# Altium project radxa_c200_io_board_v1.11.PrjPcb (part 6 of 8)

## Sheet 16_HDMI&DP.SchDoc: C200
size 594 x 420 mm; Page Create Date: March  8, 1995; Page Number: 16; Page Size: A2; Comment: radxa_1010; Page Count: 21; RevCode: V1.11; Doc: 16_HDMI&DP; DsnPath: D:\WMS\C200\CC122\对外\C200 V1.11.DSN; SchematicName: c200; PageName: 16_HDMI&DP; PageSize: A2; TopSchematic: True
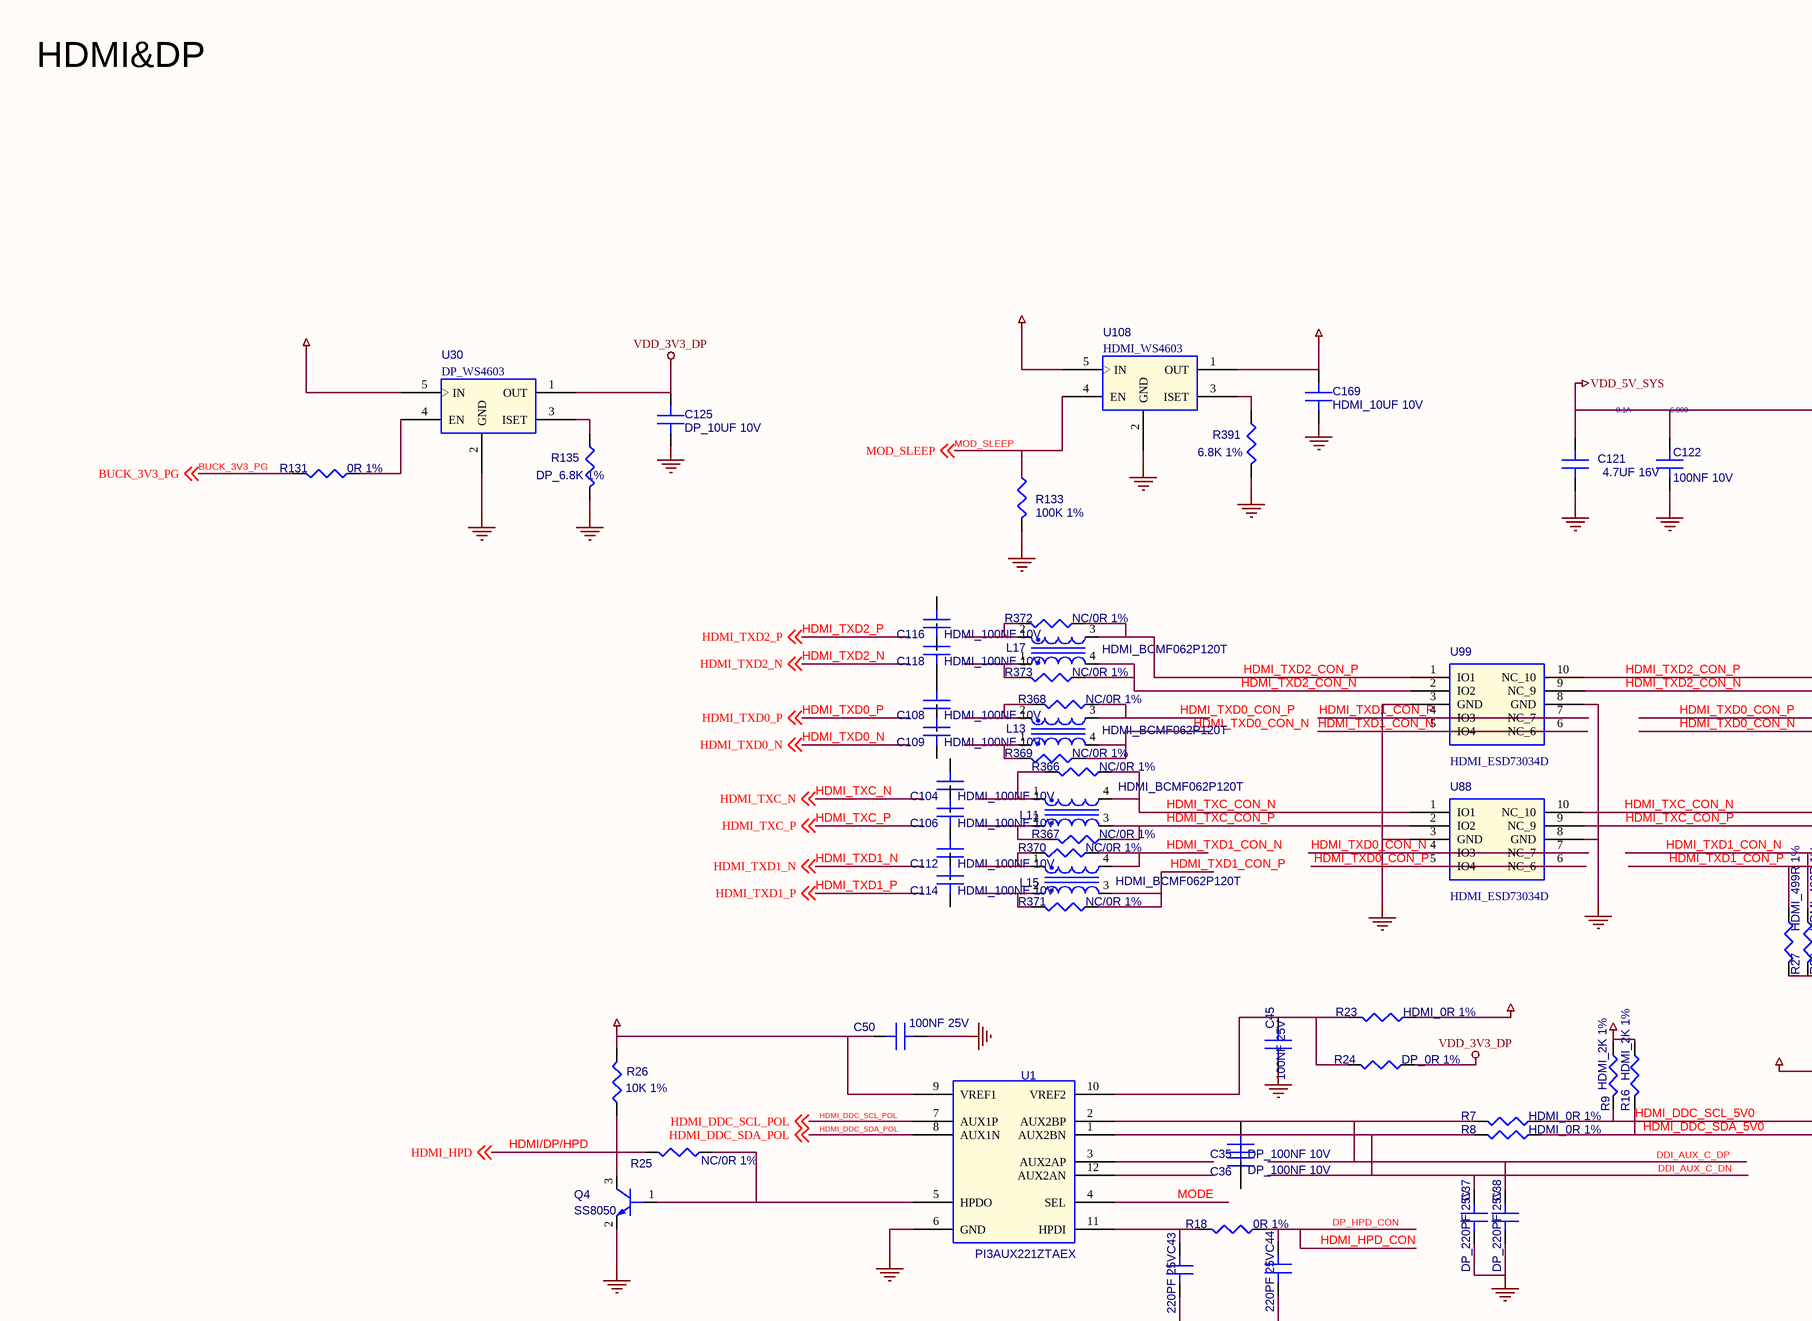
[diagram p30: 16_HDMI&DP.SchDoc, top left]
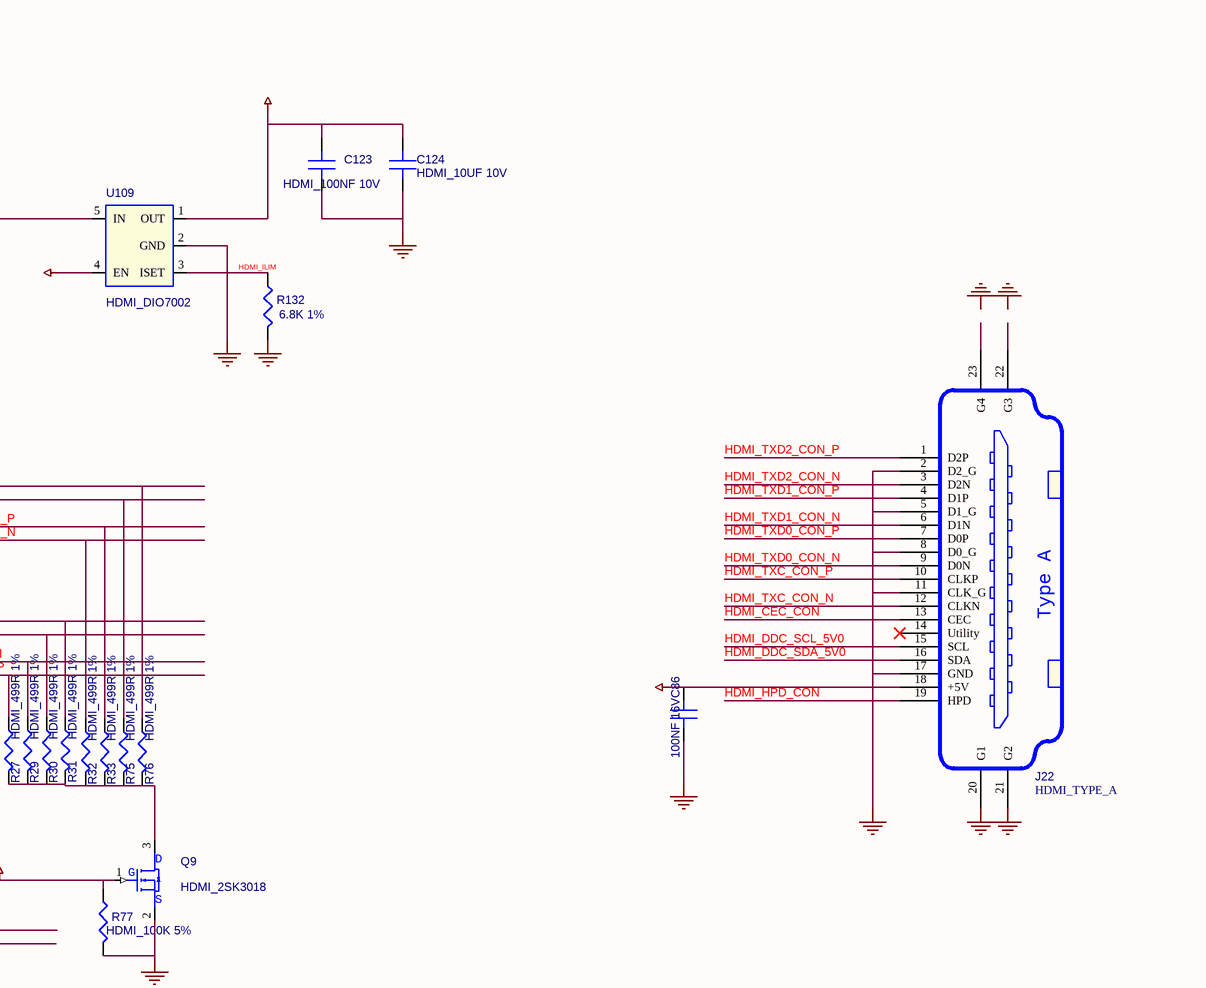
[diagram p31: 16_HDMI&DP.SchDoc, top right]
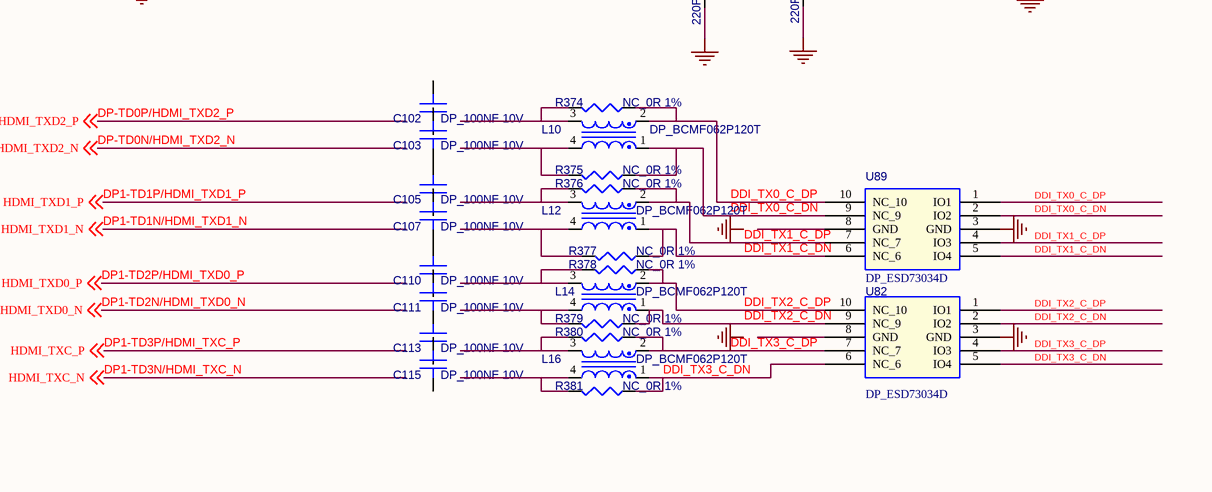
[diagram p32: 16_HDMI&DP.SchDoc, bottom left]
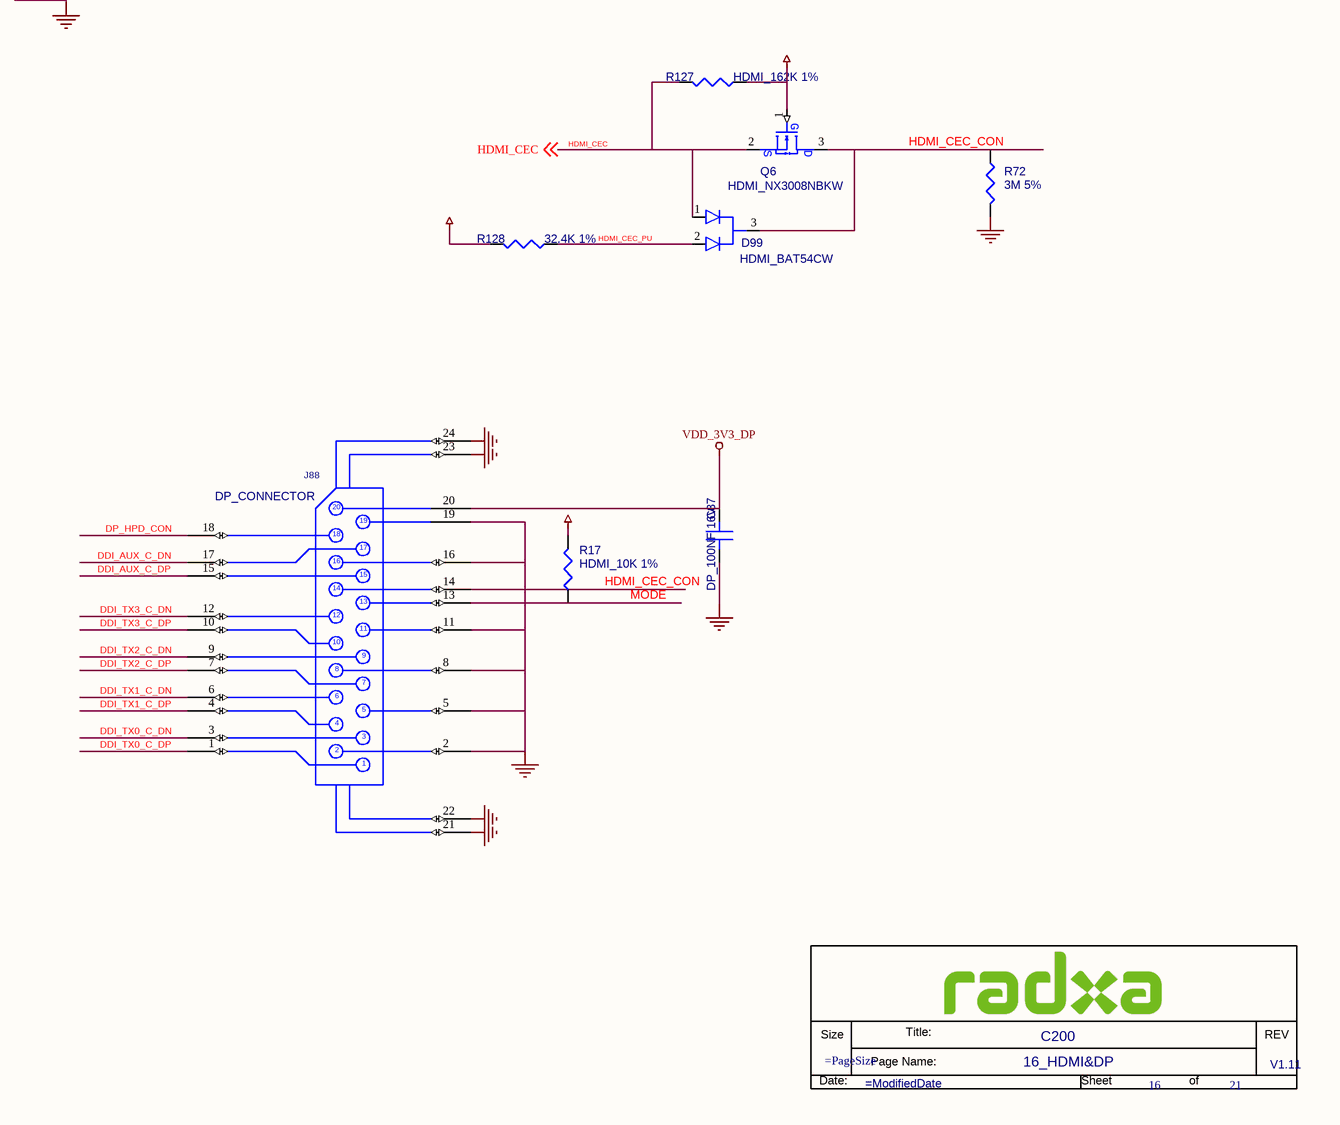
[diagram p33: 16_HDMI&DP.SchDoc, bottom right]

### Parts
(Parts that share a designator on the sheet are numbered #1, #2 ... from top to bottom, then left to right.)
*#15  Doc: 16_HDMI&DP  RevCode: V1.11  Title: C200  Page Number: 16  Page Count: 21  (hidden comment: radxa_1010)  (graphical)
C35  DP_100NF 10V  [C0402]
C36  DP_100NF 10V  [C0402]
C37  DP_220PF 25V  [C0201]
C38  DP_220PF 25V  [C0201]
C43  220PF 25V  [C0201]
C44  220PF 25V  [C0201]
C45  100NF 25V  [C0402]
C50  100NF 25V  [C0402]
C86  100NF 16V  [C0201]
C87  DP_100NF 16V  [C0201]
C102  DP_100NF 10V  [C0402]
C103  DP_100NF 10V  [C0402]
C104  HDMI_100NF 10V  [C0402]
C105  DP_100NF 10V  [C0402]
C106  HDMI_100NF 10V  [C0402]
C107  DP_100NF 10V  [C0402]
C108  HDMI_100NF 10V  [C0402]
C109  HDMI_100NF 10V  [C0402]
C110  DP_100NF 10V  [C0402]
C111  DP_100NF 10V  [C0402]
C112  HDMI_100NF 10V  [C0402]
C113  DP_100NF 10V  [C0402]
C114  HDMI_100NF 10V  [C0402]
C115  DP_100NF 10V  [C0402]
C116  HDMI_100NF 10V  [C0402]
C118  HDMI_100NF 10V  [C0402]
C121  4.7UF 16V  [C0603]
C122  100NF 10V  [C0402]
C123  HDMI_100NF 10V  [C0402]
C124  HDMI_10UF 10V  [C0603]
C125  DP_10UF 10V  [C0603]
C169  HDMI_10UF 10V  [C0603]
D99  HDMI_BAT54CW  [SOT323]
J22  HDMI_TYPE_A  [HDMI_SM19_0D5_LIE]
J88  DP_CONNECTOR  [DP_SM20_17D0X17D0]
L10  DP_BCMF062P120T  [LC1210]
L11  HDMI_BCMF062P120T  [LC1210]
L12  DP_BCMF062P120T  [LC1210]
L13  HDMI_BCMF062P120T  [LC1210]
L14  DP_BCMF062P120T  [LC1210]
L15  HDMI_BCMF062P120T  [LC1210]
L16  DP_BCMF062P120T  [LC1210]
L17  HDMI_BCMF062P120T  [LC1210]
Q4  SS8050  [SOT_323]
Q6  HDMI_NX3008NBKW  [SOT_323]
Q9  HDMI_2SK3018  [SOT_323]
R7  HDMI_0R 1%  [R0402]
R8  HDMI_0R 1%  [R0402]
R9  HDMI_2K 1%  [R0402]
R16  HDMI_2K 1%  [R0402]
R17  HDMI_10K 1%  [R0402]
R18  0R 1%  [R0402]
R23  HDMI_0R 1%  [R0402]
R24  DP_0R 1%  [R0402]
R25  NC/0R 1%  [R0402]
R26  10K 1%  [R0402]
R27  HDMI_499R 1%  [R0402]
R29  HDMI_499R 1%  [R0402]
R30  HDMI_499R 1%  [R0402]
R31  HDMI_499R 1%  [R0402]
R32  HDMI_499R 1%  [R0402]
R33  HDMI_499R 1%  [R0402]
R72  3M 5%  [R0402]
R75  HDMI_499R 1%  [R0402]
R76  HDMI_499R 1%  [R0402]
R77  HDMI_100K 5%  [R0402]
R127  HDMI_162K 1%  [R0402]
R128  32.4K 1%  [R0402]
R131  0R 1%  [R0402]
R132  6.8K 1%  [R0402]
R133  100K 1%  [R0402]
R135  DP_6.8K 1%  [R0402]
R366  NC/0R 1%  [R0402]
R367  NC/0R 1%  [R0402]
R368  NC/0R 1%  [R0402]
R369  NC/0R 1%  [R0402]
R370  NC/0R 1%  [R0402]
R371  NC/0R 1%  [R0402]
R372  NC/0R 1%  [R0402]
R373  NC/0R 1%  [R0402]
R374  NC_0R 1%  [R0402]
R375  NC_0R 1%  [R0402]
R376  NC_0R 1%  [R0402]
R377  NC_0R 1%  [R0402]
R378  NC_0R 1%  [R0402]
R379  NC_0R 1%  [R0402]
R380  NC_0R 1%  [R0402]
R381  NC_0R 1%  [R0402]
R391  6.8K 1%  [R0402]
U1  PI3AUX221ZTAEX  [UQFN12_0D4_2]
U30  DP_WS4603  [SOT23_5]
U82  DP_ESD73034D  [XSON10_0D5_1D1X2D6]
U88  HDMI_ESD73034D  [XSON10_0D5_1D1X2D6]
U89  DP_ESD73034D  [XSON10_0D5_1D1X2D6]
U99  HDMI_ESD73034D  [XSON10_0D5_1D1X2D6]
U108  HDMI_WS4603  [SOT23_5]
U109  HDMI_DIO7002  [SOT23_5]

### Nets
GND: C37.2(B) C38.2(B) C43.2(B) C44.2(B) C45.2(B) C50.2(B) C86.2(B) C87.2(B) C121.2(B) C122.2(B) C123.2(B) C124.2(B) C125.2(B) C169.2(B) J22.2(D2_G) J22.5(D1_G) J22.8(D0_G) J22.11(CLK_G) J22.17(GND) J22.20(G1) J22.21(G2) J88.2(GND_1) J88.5(GND_2) J88.8(GND_3) J88.11(GND_4) J88.16(GND_7) J88.19(PWR_RET) J88.21(SHIELD1) J88.22(SHIELD2) J88.23(SHIELD3) J88.24(SHIELD4) Q4.2(EMITTER) Q9.2(S) R72.2 R77.2 R132.1 R133.2 R135.1 R391.1 U1.6(GND) U30.2(GND) U82.3(GND) U88.3(GND) U88.8(GND) U89.3(GND) U99.3(GND) U99.8(GND) U108.2(GND) U109.2(GND)  [project net HUB2_SSTX_N_J25]
VDD_1V8: C50.1(A) R26.1 U1.9(VREF1)
VDD_3V3_DP: C87.1(A) C125.1(A) J88.20(PWR) R24.2 U30.1(OUT)
VDD_3V3_HDMI: C169.1(A) Q6.1(G) Q9.1(G) R77.1 R127.2 R128.1 U108.1(OUT) U109.4(EN)
VDD_3V3_SYS: U30.5(IN) U108.5(IN)  [project net 3V3]
VDD_5V0_HDMI_CON: C86.1(A) C123.1(A) C124.1(A) J22.18(+5V) R9.1 R16.1 R17.1 R23.2 U109.1(OUT)
VDD_5V_SYS: C121.1(A) C122.1(A) U109.5(IN)  [project net PC_LED+]
BUCK_3V3_PG: R131.1 ; off-sheet BUCK_3V3_PG
DDI_AUX_C_DN: C36.1(A) C37.1(A) J88.17(AUXN) R8.1 U1.1(AUX2BN)
DDI_AUX_C_DP: C35.1(A) C38.1(A) J88.15(AUXP) R7.1 U1.2(AUX2BP)
DDI_TX0_C_DN: J88.3(LANE_0N) L10.1 R375.2 U89.2(IO2) U89.9(NC_9)
DDI_TX0_C_DP: J88.1(LANE_0P) L10.2 R374.2 U89.1(IO1) U89.10(NC_10)
DDI_TX1_C_DN: J88.6(LANE_1N) L12.1 R377.2 U89.5(IO4) U89.6(NC_6)
DDI_TX1_C_DP: J88.4(LANE_1P) L12.2 R376.2 U89.4(IO3) U89.7(NC_7)
DDI_TX2_C_DN: J88.9(LANE_2N) L14.1 R379.2 U82.2(IO2) U82.9(NC_9)
DDI_TX2_C_DP: J88.7(LANE_2P) L14.2 R378.2 U82.1(IO1) U82.10(NC_10)
DDI_TX3_C_DN: J88.12(LANE_3N) L16.1 R381.2 U82.5(IO4) U82.6(NC_6)
DDI_TX3_C_DP: J88.10(LANE_3P) L16.2 R380.2 U82.4(IO3) U82.7(NC_7)
DP_HPD_CON: C44.1(A) J22.19(HPD) J88.18(HPD) R18.2  [also labelled HDMI_HPD_CON]
HDMI/DP/HPD: Q4.3(COLLECTOR) R25.1 R26.2 ; off-sheet HDMI_HPD  [also labelled HDMI_HPD]
HDMI_CEC: D99.1(A1) Q6.2(S) R127.1 ; off-sheet HDMI_CEC
HDMI_CEC_CON: D99.3(CC) J22.13(CEC) J88.14(CEC_DP) Q6.3(D) R72.1
HDMI_CEC_PU: D99.2(A2) R128.2
HDMI_DDC_SCL_5V0: J22.15(SCL) J22.16(SDA) R7.2 R8.2 R9.2 R16.2  [also labelled HDMI_DDC_SDA_5V0]
HDMI_DDC_SCL_POL: U1.7(AUX1P) ; off-sheet HDMI_DDC_SCL_POL
HDMI_DDC_SDA_POL: U1.8(AUX1N) ; off-sheet HDMI_DDC_SDA_POL
HDMI_ILIM: R132.2 U109.3(ISET)
HDMI_TXC_CON_N: J22.12(CLKN) L11.4 R31.1 R366.2 U88.1(IO1) U88.10(NC_10)
HDMI_TXC_CON_P: J22.10(CLKP) L11.3 R30.1 R367.2 U88.2(IO2) U88.9(NC_9)
HDMI_TXD0_CON_N: J22.9(D0N) L13.4 R32.1 R369.2 U88.4(IO3) U88.7(NC_7)
HDMI_TXD0_CON_P: J22.7(D0P) L13.3 R33.1 R368.2 U88.5(IO4) U88.6(NC_6)
HDMI_TXD1_CON_N: J22.6(D1N) L15.4 R29.1 R370.2 U99.5(IO4) U99.6(NC_6)
HDMI_TXD1_CON_P: J22.4(D1P) L15.3 R27.1 R371.2 U99.4(IO3) U99.7(NC_7)
HDMI_TXD2_CON_N: J22.3(D2N) L17.4 R75.1 R373.2 U99.2(IO2) U99.9(NC_9)
HDMI_TXD2_CON_P: J22.1(D2P) L17.3 R76.1 R372.2 U99.1(IO1) U99.10(NC_10)
MOD_SLEEP: R133.1 U108.4(EN) ; off-sheet MOD_SLEEP
MODE: J88.13(MODE) R17.2 U1.4(SEL)
NetC43_1: C43.1(A) R18.1 U1.11(HPDI)
NetC45_1: C45.1(A) R23.1 R24.1 U1.10(VREF2)
NetC103_2: C103.2(B) C105.1(A)
NetC107_2: C107.2(B) C110.1(A)
NetC108_1: C108.1(A) C118.2(B)
NetL10_3: L10.3 R374.1
NetL10_4: L10.4 R375.1
NetL11_1: L11.1 R366.1
NetL11_2: L11.2 R367.1
NetL12_3: L12.3 R376.1
NetL12_4: L12.4 R377.1
NetL13_1: L13.1 R369.1
NetL13_2: L13.2 R368.1
NetL14_3: L14.3 R378.1
NetL14_4: L14.4 R379.1
NetL15_1: L15.1 R370.1
NetL15_2: L15.2 R371.1
NetL16_3: L16.3 R380.1
NetL16_4: L16.4 R381.1
NetL17_1: L17.1 R373.1
NetL17_2: L17.2 R372.1
NetQ4_1: Q4.1(BASE) R25.2 U1.5(HPDO)
NetQ9_3: Q9.3(D) R27.2 R29.2 R30.2 R31.2 R32.2 R33.2 R75.2 R76.2
NetR131_2: R131.2 U30.4(EN)
NetR135_2: R135.2 U30.3(ISET)
NetR391_2: R391.2 U108.3(ISET)

Not connected (* = marked no-connect by the designer): C35 2(B); C36 2(B); C102 1(A) 2(B); C103 1(A); C104 1(A) 2(B); C105 2(B); C106 1(A) 2(B); C107 1(A); C108 2(B); C109 1(A) 2(B); C110 2(B); C111 1(A) 2(B); C112 1(A) 2(B); C113 1(A) 2(B); C114 1(A) 2(B); C115 1(A) 2(B); C116 1(A) 2(B); C118 1(A); J22 14(Utility)* 22(G3) 23(G4); U1 3(AUX2AP) 12(AUX2AN); U82 8(GND); U89 8(GND)

### Notes on the sheet
- HDMI&DP
- 0.1A
- (near C122) 6.000
- Labels drawn without touching a wire or pin: GND
- (in symbol HDMI_TYPE_A) Type A
- (in symbol radxa_1010) Size; Title:; REV; Page Name:; Date:; Sheet; of

### Library data of the parts
C35 = C: SMD  0402  100NF  10V  X5R  ±10%  ROHS; PARTS: 1; Part Reference: C35; CDS_PHYS_PART_NAME: C_0402-0.1UF,X5R,10%,6.3V,039-0007-000-0.1UF,039-0007-000; CDS_PART_NAME: C_0402-0.1UF,X5R,10%,6.3V,039-0007-000; Part Number: A1C01.00163; OriginalSymbolOrigin: (0,30); PKG_TYPE: CAP2-100-250; LEVEL: STD; PINSWAP: (A,B); XY: (-9150,4100); VER: 2; SIGNAL_MODEL: nv_cap; ROT: 0; PHYS_PAGE: 16; PATH: I259; PACK_TYPE: 402; NV_PN: 039-0007-000; MAX_VOLTAGE: 6.3V; DRAWING: @P3449_B01_LIB.P3449_B01(SCH_1):PAGE16; DEVICE_TYPENAME: C_0402-01UFX5R1063V039-0007-000-01UF039-0007-000; CDS_LIB: discrete; ASSEMBLY: HDMI; Value: DP_100NF 10V; SEC: 1; TOL: 10%; NO_XNET: 1; MAT: X5R; CHIPS_PART_NAME: C; CDS_SEC: 1; Part Type: 陶瓷电容; PCB Footprint: C0402
C36 = C: SMD  0402  100NF  10V  X5R  ±10%  ROHS; PARTS: 1; Part Reference: C36; CDS_PHYS_PART_NAME: C_0402-0.1UF,X5R,10%,6.3V,039-0007-000-0.1UF,039-0007-000; CDS_PART_NAME: C_0402-0.1UF,X5R,10%,6.3V,039-0007-000; Part Number: A1C01.00163; OriginalSymbolOrigin: (0,30); PKG_TYPE: CAP2-100-250; LEVEL: STD; PINSWAP: (A,B); XY: (-9150,4100); VER: 2; SIGNAL_MODEL: nv_cap; ROT: 0; PHYS_PAGE: 16; PATH: I259; PACK_TYPE: 402; NV_PN: 039-0007-000; MAX_VOLTAGE: 6.3V; DRAWING: @P3449_B01_LIB.P3449_B01(SCH_1):PAGE16; DEVICE_TYPENAME: C_0402-01UFX5R1063V039-0007-000-01UF039-0007-000; CDS_LIB: discrete; ASSEMBLY: HDMI; Value: DP_100NF 10V; SEC: 1; TOL: 10%; NO_XNET: 1; MAT: X5R; CHIPS_PART_NAME: C; CDS_SEC: 1; Part Type: 陶瓷电容; PCB Footprint: C0402
C37 = C: SMD  0201  220PF  25V  X7R  ±10%  ROHS; PARTS: 1; Part Reference: C37; Part Number: A1C01.00119; OriginalSymbolOrigin: (0,30); PKG_TYPE: CAP2-100-250; LEVEL: STD; PINSWAP: (A,B); Value: DP_220PF 25V; Part Type: 陶瓷电容; PCB Footprint: C0201
C38 = C: SMD  0201  220PF  25V  X7R  ±10%  ROHS; PARTS: 1; Part Reference: C38; Part Number: A1C01.00119; OriginalSymbolOrigin: (0,30); PKG_TYPE: CAP2-100-250; LEVEL: STD; PINSWAP: (A,B); Value: DP_220PF 25V; Part Type: 陶瓷电容; PCB Footprint: C0201
C43 = C: SMD  0201  220PF  25V  X7R  ±10%  ROHS; PARTS: 1; Part Reference: C43; Part Number: A1C01.00119; OriginalSymbolOrigin: (0,30); PKG_TYPE: CAP2-100-250; LEVEL: STD; PINSWAP: (A,B); Value: 220PF 25V; Part Type: 陶瓷电容; PCB Footprint: C0201
C44 = C: SMD  0201  220PF  25V  X7R  ±10%  ROHS; PARTS: 1; Part Reference: C44; Part Number: A1C01.00119; OriginalSymbolOrigin: (0,30); PKG_TYPE: CAP2-100-250; LEVEL: STD; PINSWAP: (A,B); Value: 220PF 25V; Part Type: 陶瓷电容; PCB Footprint: C0201
C45 = C: SMD  0402  100NF  25V  X5R  ±20%  ROHS; PARTS: 1; Part Reference: C45; Part Number: A1C01.00061; OriginalSymbolOrigin: (0,30); PKG_TYPE: CAP2-100-250; LEVEL: STD; PINSWAP: (A,B); Value: 100NF 25V; Part Type: 陶瓷电容; PCB Footprint: C0402
C50 = C: SMD  0402  100NF  25V  X5R  ±20%  ROHS; PARTS: 1; Part Reference: C50; Part Number: A1C01.00061; OriginalSymbolOrigin: (0,30); PKG_TYPE: CAP2-100-250; LEVEL: STD; PINSWAP: (A,B); Value: 100NF 25V; Part Type: 陶瓷电容; PCB Footprint: C0402
C86 = C: SMD  0201  100NF  16V  X7R  ±20%  ROHS; PARTS: 1; Part Reference: C86; Part Number: A1C01.00381; OriginalSymbolOrigin: (0,30); PKG_TYPE: CAP2-100-250; LEVEL: STD; PINSWAP: (A,B); Value: 100NF 16V; Part Type: 陶瓷电容; PCB Footprint: C0201
C87 = C: SMD  0201  100NF  16V  X7R  ±20%  ROHS; PARTS: 1; Part Reference: C87; Part Number: A1C01.00381; OriginalSymbolOrigin: (0,30); PKG_TYPE: CAP2-100-250; LEVEL: STD; PINSWAP: (A,B); Value: DP_100NF 16V; Part Type: 陶瓷电容; PCB Footprint: C0201
C102 = C: SMD  0402  100NF  10V  X5R  ±10%  ROHS; PARTS: 1; Part Reference: C102; CDS_PHYS_PART_NAME: C_0402-0.1UF,X5R,10%,6.3V,039-0007-000-0.1UF,039-0007-000; CDS_PART_NAME: C_0402-0.1UF,X5R,10%,6.3V,039-0007-000; Part Number: A1C01.00163; OriginalSymbolOrigin: (0,30); PKG_TYPE: CAP2-100-250; LEVEL: STD; PINSWAP: (A,B); XY: (-9150,4100); VER: 2; SIGNAL_MODEL: nv_cap; ROT: 0; PHYS_PAGE: 16; PATH: I259; PACK_TYPE: 402; NV_PN: 039-0007-000; MAX_VOLTAGE: 6.3V; DRAWING: @P3449_B01_LIB.P3449_B01(SCH_1):PAGE16; DEVICE_TYPENAME: C_0402-01UFX5R1063V039-0007-000-01UF039-0007-000; CDS_LIB: discrete; ASSEMBLY: HDMI; Value: DP_100NF 10V; SEC: 1; TOL: 10%; NO_XNET: 1; MAT: X5R; CHIPS_PART_NAME: C; CDS_SEC: 1; Part Type: 陶瓷电容; PCB Footprint: C0402
C103 = C: SMD  0402  100NF  10V  X5R  ±10%  ROHS; PARTS: 1; Part Reference: C103; CDS_PHYS_PART_NAME: C_0402-0.1UF,X5R,10%,6.3V,039-0007-000-0.1UF,039-0007-000; CDS_PART_NAME: C_0402-0.1UF,X5R,10%,6.3V,039-0007-000; Part Number: A1C01.00163; OriginalSymbolOrigin: (0,30); PKG_TYPE: CAP2-100-250; LEVEL: STD; PINSWAP: (A,B); XY: (-9150,4100); VER: 2; SIGNAL_MODEL: nv_cap; ROT: 0; PHYS_PAGE: 16; PATH: I259; PACK_TYPE: 402; NV_PN: 039-0007-000; MAX_VOLTAGE: 6.3V; DRAWING: @P3449_B01_LIB.P3449_B01(SCH_1):PAGE16; DEVICE_TYPENAME: C_0402-01UFX5R1063V039-0007-000-01UF039-0007-000; CDS_LIB: discrete; ASSEMBLY: HDMI; Value: DP_100NF 10V; SEC: 1; TOL: 10%; NO_XNET: 1; MAT: X5R; CHIPS_PART_NAME: C; CDS_SEC: 1; Part Type: 陶瓷电容; PCB Footprint: C0402
C104 = C: SMD  0402  100NF  10V  X5R  ±10%  ROHS; PARTS: 1; Part Reference: C104; Part Number: A1C01.00163; CDS_PART_NAME: C_0402-0.1UF,X5R,10%,6.3V,039-0007-000; CDS_PHYS_PART_NAME: C_0402-0.1UF,X5R,10%,6.3V,039-0007-000-0.1UF,039-0007-000; OriginalSymbolOrigin: (0,30); PKG_TYPE: CAP2-100-250; LEVEL: STD; PINSWAP: (A,B); ASSEMBLY: HDMI; CDS_LIB: discrete; DEVICE_TYPENAME: C_0402-01UFX5R1063V039-0007-000-01UF039-0007-000; DRAWING: @P3449_B01_LIB.P3449_B01(SCH_1):PAGE16; MAX_VOLTAGE: 6.3V; NV_PN: 039-0007-000; PACK_TYPE: 402; PATH: I259; PHYS_PAGE: 16; ROT: 0; SIGNAL_MODEL: nv_cap; VER: 2; XY: (-9150,4100); Value: HDMI_100NF 10V; Part Type: 陶瓷电容; CDS_SEC: 1; CHIPS_PART_NAME: C; MAT: X5R; NO_XNET: 1; TOL: 10%; SEC: 1; PCB Footprint: C0402
C105 = C: SMD  0402  100NF  10V  X5R  ±10%  ROHS; PARTS: 1; Part Reference: C105; CDS_PHYS_PART_NAME: C_0402-0.1UF,X5R,10%,6.3V,039-0007-000-0.1UF,039-0007-000; CDS_PART_NAME: C_0402-0.1UF,X5R,10%,6.3V,039-0007-000; Part Number: A1C01.00163; OriginalSymbolOrigin: (0,30); PKG_TYPE: CAP2-100-250; LEVEL: STD; PINSWAP: (A,B); XY: (-9150,4100); VER: 2; SIGNAL_MODEL: nv_cap; ROT: 0; PHYS_PAGE: 16; PATH: I259; PACK_TYPE: 402; NV_PN: 039-0007-000; MAX_VOLTAGE: 6.3V; DRAWING: @P3449_B01_LIB.P3449_B01(SCH_1):PAGE16; DEVICE_TYPENAME: C_0402-01UFX5R1063V039-0007-000-01UF039-0007-000; CDS_LIB: discrete; ASSEMBLY: HDMI; Value: DP_100NF 10V; SEC: 1; TOL: 10%; NO_XNET: 1; MAT: X5R; CHIPS_PART_NAME: C; CDS_SEC: 1; Part Type: 陶瓷电容; PCB Footprint: C0402
C106 = C: SMD  0402  100NF  10V  X5R  ±10%  ROHS; PARTS: 1; Part Reference: C106; CDS_PHYS_PART_NAME: C_0402-0.1UF,X5R,10%,6.3V,039-0007-000-0.1UF,039-0007-000; CDS_PART_NAME: C_0402-0.1UF,X5R,10%,6.3V,039-0007-000; Part Number: A1C01.00163; OriginalSymbolOrigin: (0,30); PKG_TYPE: CAP2-100-250; LEVEL: STD; PINSWAP: (A,B); XY: (-9150,4100); VER: 2; SIGNAL_MODEL: nv_cap; ROT: 0; PHYS_PAGE: 16; PATH: I259; PACK_TYPE: 402; NV_PN: 039-0007-000; MAX_VOLTAGE: 6.3V; DRAWING: @P3449_B01_LIB.P3449_B01(SCH_1):PAGE16; DEVICE_TYPENAME: C_0402-01UFX5R1063V039-0007-000-01UF039-0007-000; CDS_LIB: discrete; ASSEMBLY: HDMI; Value: HDMI_100NF 10V; SEC: 1; TOL: 10%; NO_XNET: 1; MAT: X5R; CHIPS_PART_NAME: C; CDS_SEC: 1; Part Type: 陶瓷电容; PCB Footprint: C0402
C107 = C: SMD  0402  100NF  10V  X5R  ±10%  ROHS; PARTS: 1; Part Reference: C107; CDS_PHYS_PART_NAME: C_0402-0.1UF,X5R,10%,6.3V,039-0007-000-0.1UF,039-0007-000; CDS_PART_NAME: C_0402-0.1UF,X5R,10%,6.3V,039-0007-000; Part Number: A1C01.00163; OriginalSymbolOrigin: (0,30); PKG_TYPE: CAP2-100-250; LEVEL: STD; PINSWAP: (A,B); XY: (-9150,4100); VER: 2; SIGNAL_MODEL: nv_cap; ROT: 0; PHYS_PAGE: 16; PATH: I259; PACK_TYPE: 402; NV_PN: 039-0007-000; MAX_VOLTAGE: 6.3V; DRAWING: @P3449_B01_LIB.P3449_B01(SCH_1):PAGE16; DEVICE_TYPENAME: C_0402-01UFX5R1063V039-0007-000-01UF039-0007-000; CDS_LIB: discrete; ASSEMBLY: HDMI; Value: DP_100NF 10V; SEC: 1; TOL: 10%; NO_XNET: 1; MAT: X5R; CHIPS_PART_NAME: C; CDS_SEC: 1; Part Type: 陶瓷电容; PCB Footprint: C0402
C108 = C: SMD  0402  100NF  10V  X5R  ±10%  ROHS; PARTS: 1; Part Reference: C108; Part Number: A1C01.00163; CDS_PART_NAME: C_0402-0.1UF,X5R,10%,6.3V,039-0007-000; CDS_PHYS_PART_NAME: C_0402-0.1UF,X5R,10%,6.3V,039-0007-000-0.1UF,039-0007-000; OriginalSymbolOrigin: (0,30); PKG_TYPE: CAP2-100-250; LEVEL: STD; PINSWAP: (A,B); ASSEMBLY: HDMI; CDS_LIB: discrete; DEVICE_TYPENAME: C_0402-01UFX5R1063V039-0007-000-01UF039-0007-000; DRAWING: @P3449_B01_LIB.P3449_B01(SCH_1):PAGE16; MAX_VOLTAGE: 6.3V; NV_PN: 039-0007-000; PACK_TYPE: 402; PATH: I259; PHYS_PAGE: 16; ROT: 0; SIGNAL_MODEL: nv_cap; VER: 2; XY: (-9150,4100); Value: HDMI_100NF 10V; Part Type: 陶瓷电容; CDS_SEC: 1; CHIPS_PART_NAME: C; MAT: X5R; NO_XNET: 1; TOL: 10%; SEC: 1; PCB Footprint: C0402
C109 = C: SMD  0402  100NF  10V  X5R  ±10%  ROHS; PARTS: 1; Part Reference: C109; CDS_PHYS_PART_NAME: C_0402-0.1UF,X5R,10%,6.3V,039-0007-000-0.1UF,039-0007-000; CDS_PART_NAME: C_0402-0.1UF,X5R,10%,6.3V,039-0007-000; Part Number: A1C01.00163; OriginalSymbolOrigin: (0,30); PKG_TYPE: CAP2-100-250; LEVEL: STD; PINSWAP: (A,B); XY: (-9150,4100); VER: 2; SIGNAL_MODEL: nv_cap; ROT: 0; PHYS_PAGE: 16; PATH: I259; PACK_TYPE: 402; NV_PN: 039-0007-000; MAX_VOLTAGE: 6.3V; DRAWING: @P3449_B01_LIB.P3449_B01(SCH_1):PAGE16; DEVICE_TYPENAME: C_0402-01UFX5R1063V039-0007-000-01UF039-0007-000; CDS_LIB: discrete; ASSEMBLY: HDMI; Value: HDMI_100NF 10V; SEC: 1; TOL: 10%; NO_XNET: 1; MAT: X5R; CHIPS_PART_NAME: C; CDS_SEC: 1; Part Type: 陶瓷电容; PCB Footprint: C0402
C110 = C: SMD  0402  100NF  10V  X5R  ±10%  ROHS; PARTS: 1; Part Reference: C110; CDS_PHYS_PART_NAME: C_0402-0.1UF,X5R,10%,6.3V,039-0007-000-0.1UF,039-0007-000; CDS_PART_NAME: C_0402-0.1UF,X5R,10%,6.3V,039-0007-000; Part Number: A1C01.00163; OriginalSymbolOrigin: (0,30); PKG_TYPE: CAP2-100-250; LEVEL: STD; PINSWAP: (A,B); XY: (-9150,4100); VER: 2; SIGNAL_MODEL: nv_cap; ROT: 0; PHYS_PAGE: 16; PATH: I259; PACK_TYPE: 402; NV_PN: 039-0007-000; MAX_VOLTAGE: 6.3V; DRAWING: @P3449_B01_LIB.P3449_B01(SCH_1):PAGE16; DEVICE_TYPENAME: C_0402-01UFX5R1063V039-0007-000-01UF039-0007-000; CDS_LIB: discrete; ASSEMBLY: HDMI; Value: DP_100NF 10V; SEC: 1; TOL: 10%; NO_XNET: 1; MAT: X5R; CHIPS_PART_NAME: C; CDS_SEC: 1; Part Type: 陶瓷电容; PCB Footprint: C0402
C111 = C: SMD  0402  100NF  10V  X5R  ±10%  ROHS; PARTS: 1; Part Reference: C111; Part Number: A1C01.00163; CDS_PART_NAME: C_0402-0.1UF,X5R,10%,6.3V,039-0007-000; CDS_PHYS_PART_NAME: C_0402-0.1UF,X5R,10%,6.3V,039-0007-000-0.1UF,039-0007-000; OriginalSymbolOrigin: (0,30); PKG_TYPE: CAP2-100-250; LEVEL: STD; PINSWAP: (A,B); ASSEMBLY: HDMI; CDS_LIB: discrete; DEVICE_TYPENAME: C_0402-01UFX5R1063V039-0007-000-01UF039-0007-000; DRAWING: @P3449_B01_LIB.P3449_B01(SCH_1):PAGE16; MAX_VOLTAGE: 6.3V; NV_PN: 039-0007-000; PACK_TYPE: 402; PATH: I259; PHYS_PAGE: 16; ROT: 0; SIGNAL_MODEL: nv_cap; VER: 2; XY: (-9150,4100); Value: DP_100NF 10V; Part Type: 陶瓷电容; CDS_SEC: 1; CHIPS_PART_NAME: C; MAT: X5R; NO_XNET: 1; TOL: 10%; SEC: 1; PCB Footprint: C0402
C112 = C: SMD  0402  100NF  10V  X5R  ±10%  ROHS; PARTS: 1; Part Reference: C112; CDS_PHYS_PART_NAME: C_0402-0.1UF,X5R,10%,6.3V,039-0007-000-0.1UF,039-0007-000; CDS_PART_NAME: C_0402-0.1UF,X5R,10%,6.3V,039-0007-000; Part Number: A1C01.00163; OriginalSymbolOrigin: (0,30); PKG_TYPE: CAP2-100-250; LEVEL: STD; PINSWAP: (A,B); XY: (-9150,4100); VER: 2; SIGNAL_MODEL: nv_cap; ROT: 0; PHYS_PAGE: 16; PATH: I259; PACK_TYPE: 402; NV_PN: 039-0007-000; MAX_VOLTAGE: 6.3V; DRAWING: @P3449_B01_LIB.P3449_B01(SCH_1):PAGE16; DEVICE_TYPENAME: C_0402-01UFX5R1063V039-0007-000-01UF039-0007-000; CDS_LIB: discrete; ASSEMBLY: HDMI; Value: HDMI_100NF 10V; SEC: 1; TOL: 10%; NO_XNET: 1; MAT: X5R; CHIPS_PART_NAME: C; CDS_SEC: 1; Part Type: 陶瓷电容; PCB Footprint: C0402
C113 = C: SMD  0402  100NF  10V  X5R  ±10%  ROHS; PARTS: 1; Part Reference: C113; Part Number: A1C01.00163; CDS_PART_NAME: C_0402-0.1UF,X5R,10%,6.3V,039-0007-000; CDS_PHYS_PART_NAME: C_0402-0.1UF,X5R,10%,6.3V,039-0007-000-0.1UF,039-0007-000; OriginalSymbolOrigin: (0,30); PKG_TYPE: CAP2-100-250; LEVEL: STD; PINSWAP: (A,B); ASSEMBLY: HDMI; CDS_LIB: discrete; DEVICE_TYPENAME: C_0402-01UFX5R1063V039-0007-000-01UF039-0007-000; DRAWING: @P3449_B01_LIB.P3449_B01(SCH_1):PAGE16; MAX_VOLTAGE: 6.3V; NV_PN: 039-0007-000; PACK_TYPE: 402; PATH: I259; PHYS_PAGE: 16; ROT: 0; SIGNAL_MODEL: nv_cap; VER: 2; XY: (-9150,4100); Value: DP_100NF 10V; Part Type: 陶瓷电容; CDS_SEC: 1; CHIPS_PART_NAME: C; MAT: X5R; NO_XNET: 1; TOL: 10%; SEC: 1; PCB Footprint: C0402
C114 = C: SMD  0402  100NF  10V  X5R  ±10%  ROHS; PARTS: 1; Part Reference: C114; Part Number: A1C01.00163; CDS_PART_NAME: C_0402-0.1UF,X5R,10%,6.3V,039-0007-000; CDS_PHYS_PART_NAME: C_0402-0.1UF,X5R,10%,6.3V,039-0007-000-0.1UF,039-0007-000; OriginalSymbolOrigin: (0,30); PKG_TYPE: CAP2-100-250; LEVEL: STD; PINSWAP: (A,B); ASSEMBLY: HDMI; CDS_LIB: discrete; DEVICE_TYPENAME: C_0402-01UFX5R1063V039-0007-000-01UF039-0007-000; DRAWING: @P3449_B01_LIB.P3449_B01(SCH_1):PAGE16; MAX_VOLTAGE: 6.3V; NV_PN: 039-0007-000; PACK_TYPE: 402; PATH: I259; PHYS_PAGE: 16; ROT: 0; SIGNAL_MODEL: nv_cap; VER: 2; XY: (-9150,4100); Value: HDMI_100NF 10V; Part Type: 陶瓷电容; CDS_SEC: 1; CHIPS_PART_NAME: C; MAT: X5R; NO_XNET: 1; TOL: 10%; SEC: 1; PCB Footprint: C0402
C115 = C: SMD  0402  100NF  10V  X5R  ±10%  ROHS; PARTS: 1; Part Reference: C115; Part Number: A1C01.00163; CDS_PART_NAME: C_0402-0.1UF,X5R,10%,6.3V,039-0007-000; CDS_PHYS_PART_NAME: C_0402-0.1UF,X5R,10%,6.3V,039-0007-000-0.1UF,039-0007-000; OriginalSymbolOrigin: (0,30); PKG_TYPE: CAP2-100-250; LEVEL: STD; PINSWAP: (A,B); ASSEMBLY: HDMI; CDS_LIB: discrete; DEVICE_TYPENAME: C_0402-01UFX5R1063V039-0007-000-01UF039-0007-000; DRAWING: @P3449_B01_LIB.P3449_B01(SCH_1):PAGE16; MAX_VOLTAGE: 6.3V; NV_PN: 039-0007-000; PACK_TYPE: 402; PATH: I259; PHYS_PAGE: 16; ROT: 0; SIGNAL_MODEL: nv_cap; VER: 2; XY: (-9150,4100); Value: DP_100NF 10V; Part Type: 陶瓷电容; CDS_SEC: 1; CHIPS_PART_NAME: C; MAT: X5R; NO_XNET: 1; TOL: 10%; SEC: 1; PCB Footprint: C0402
C116 = C: SMD  0402  100NF  10V  X5R  ±10%  ROHS; PARTS: 1; Part Reference: C116; Part Number: A1C01.00163; CDS_PART_NAME: C_0402-0.1UF,X5R,10%,6.3V,039-0007-000; CDS_PHYS_PART_NAME: C_0402-0.1UF,X5R,10%,6.3V,039-0007-000-0.1UF,039-0007-000; OriginalSymbolOrigin: (0,30); PKG_TYPE: CAP2-100-250; LEVEL: STD; PINSWAP: (A,B); ASSEMBLY: HDMI; CDS_LIB: discrete; DEVICE_TYPENAME: C_0402-01UFX5R1063V039-0007-000-01UF039-0007-000; DRAWING: @P3449_B01_LIB.P3449_B01(SCH_1):PAGE16; MAX_VOLTAGE: 6.3V; NV_PN: 039-0007-000; PACK_TYPE: 402; PATH: I259; PHYS_PAGE: 16; ROT: 0; SIGNAL_MODEL: nv_cap; VER: 2; XY: (-9150,4100); Value: HDMI_100NF 10V; Part Type: 陶瓷电容; CDS_SEC: 1; CHIPS_PART_NAME: C; MAT: X5R; NO_XNET: 1; TOL: 10%; SEC: 1; PCB Footprint: C0402
C118 = C: SMD  0402  100NF  10V  X5R  ±10%  ROHS; PARTS: 1; Part Reference: C118; CDS_PHYS_PART_NAME: C_0402-0.1UF,X5R,10%,6.3V,039-0007-000-0.1UF,039-0007-000; CDS_PART_NAME: C_0402-0.1UF,X5R,10%,6.3V,039-0007-000; Part Number: A1C01.00163; OriginalSymbolOrigin: (0,30); PKG_TYPE: CAP2-100-250; LEVEL: STD; PINSWAP: (A,B); XY: (-9150,4100); VER: 2; SIGNAL_MODEL: nv_cap; ROT: 0; PHYS_PAGE: 16; PATH: I259; PACK_TYPE: 402; NV_PN: 039-0007-000; MAX_VOLTAGE: 6.3V; DRAWING: @P3449_B01_LIB.P3449_B01(SCH_1):PAGE16; DEVICE_TYPENAME: C_0402-01UFX5R1063V039-0007-000-01UF039-0007-000; CDS_LIB: discrete; ASSEMBLY: HDMI; Value: HDMI_100NF 10V; SEC: 1; TOL: 10%; NO_XNET: 1; MAT: X5R; CHIPS_PART_NAME: C; CDS_SEC: 1; Part Type: 陶瓷电容; PCB Footprint: C0402
C121 = C: SMD  0603  4.7UF  16V  X5R  ±10%  ROHS; PARTS: 1; Part Reference: C121; Part Number: A1C01.00239; OriginalSymbolOrigin: (0,30); PKG_TYPE: CAP2-100-250; LEVEL: STD; PINSWAP: (A,B); Value: 4.7UF 16V; Part Type: 陶瓷电容; PCB Footprint: C0603
C122 = C: SMD  0402  100NF  10V  X5R  ±10%  ROHS; PARTS: 1; Part Reference: C122; Part Number: A1C01.00163; OriginalSymbolOrigin: (0,30); PKG_TYPE: CAP2-100-250; LEVEL: STD; PINSWAP: (A,B); Value: 100NF 10V; Part Type: 陶瓷电容; PCB Footprint: C0402
C123 = C: SMD  0402  100NF  10V  X5R  ±10%  ROHS; PARTS: 1; Part Reference: C123; Part Number: A1C01.00163; OriginalSymbolOrigin: (0,30); PKG_TYPE: CAP2-100-250; LEVEL: STD; PINSWAP: (A,B); Value: HDMI_100NF 10V; Part Type: 陶瓷电容; PCB Footprint: C0402
C124 = C: SMD  0603  10UF  10V  X5R  ±10%  ROHS; PARTS: 1; Part Reference: C124; Part Number: A1C01.00270; OriginalSymbolOrigin: (0,30); PKG_TYPE: CAP2-100-250; LEVEL: STD; PINSWAP: (A,B); Value: HDMI_10UF 10V; Part Type: 陶瓷电容; PCB Footprint: C0603
C125 = C: SMD  0603  10UF  10V  X5R  ±10%  ROHS; PARTS: 1; Part Reference: C125; Part Number: A1C01.00270; OriginalSymbolOrigin: (0,30); PKG_TYPE: CAP2-100-250; LEVEL: STD; PINSWAP: (A,B); Value: DP_10UF 10V; Part Type: 陶瓷电容; PCB Footprint: C0603
C169 = C: SMD  0603  10UF  10V  X5R  ±10%  ROHS; PARTS: 1; Part Reference: C169; Part Number: A1C01.00270; OriginalSymbolOrigin: (0,30); PKG_TYPE: CAP2-100-250; LEVEL: STD; PINSWAP: (A,B); Value: HDMI_10UF 10V; Part Type: 陶瓷电容; PCB Footprint: C0603
D99 = DIODE_S_3P: SMD  编带  SOT-323  BAT54CW  长电  ROHS; Part Reference: D99; Part Number: A1D02.00114; OriginalSymbolOrigin: (-50,100); PSPICETEMPLATE: X^@REFDES %a1 %a2 %cc @NV_PN; IMPLEMENTATION_TYPE: Pspice Model; PCB Footprint: SOT_323; SKU: COMMON; PLACEMENT_NOTE: ?; PATH: ?; PACK_TYPE: ?; NV_PN: ?; NV_NAME: ?; MAX_VOLTAGE: ?; MAX_CURRENT: ?; FORWARD_VOLTAGE: ?; CONTINUOUS_CURRENT: ?; CONFIGURATION: ?; ASSEMBLY: ?; Value: HDMI_BAT54CW; Part Type: 二极管-ESD管-桥堆-TVS管
J22 = HDMI_TYPE_A: SMD  A座  19PIN  180度  卧贴  12.1*15*6.05mm  镀镍  脚距14.5mm  916000-000004  ROHS WLDM-094E  ROHS; Part Reference: J22; Part Number: A1J04.00005; Parameter: 连接器-HDMI公母-19P/型号：10029449-001RLF-封装 hdmia19_hdmi_01a; Value: HDMI_TYPE_A; Part Type: HDMI座; PCB Footprint: HDMI_SM19_0D5_LIE
J88 = DP: SMD  DP座  20PIN  17.9*14.5*H6.5mm  0.5mm脚距  带定位柱  BDPF20B1N11084SR  BVT-LINK  ROHS; Part Reference: J88; Part Number: A1J14.00020; OriginalSymbolOrigin: (-450,800); SKU: COMMON; SHROUDED: ?; SHIELDED: ?; REFLOW: ?; PLACEMENT_NOTE: ?; PITCH: ?; PATH: ?; PACK_TYPE: ?; NV_PN: ?; NV_NAME: ?; MAX_VOLTAGE: ?; MAX_CURRENT: ?; LATCHING: ?; GENDER: ?; EMI_GROUND_TAB: ?; ASSEMBLY: ?; ANGLE: ?; Value: DP_CONNECTOR; Part Type: 其他座子; PCB Footprint: DP_SM20_17D0X17D0
L10 = MCZ1210AH900L2: SMD  编带  BCMF062P120T  12R  4PIN  11.98GHZ  ±5%  比创达  ROHS; Part Reference: L10; Part Number: A1L03.00011; PCB Footprint: CML_SM4_0D45_0D5; Value: DP_BCMF062P120T; Part Type: 共模电感
L11 = MCZ1210AH900L2: SMD  编带  BCMF062P120T  12R  4PIN  11.98GHZ  ±5%  比创达  ROHS; Part Reference: L11; Part Number: A1L03.00011; PCB Footprint: CML_SM4_0D45_0D5; Value: HDMI_BCMF062P120T; Part Type: 共模电感
L12 = MCZ1210AH900L2: SMD  编带  BCMF062P120T  12R  4PIN  11.98GHZ  ±5%  比创达  ROHS; Part Reference: L12; Part Number: A1L03.00011; PCB Footprint: CML_SM4_0D45_0D5; Value: DP_BCMF062P120T; Part Type: 共模电感
L13 = MCZ1210AH900L2: SMD  编带  BCMF062P120T  12R  4PIN  11.98GHZ  ±5%  比创达  ROHS; Part Reference: L13; Part Number: A1L03.00011; PCB Footprint: CML_SM4_0D45_0D5; Value: HDMI_BCMF062P120T; Part Type: 共模电感
L14 = MCZ1210AH900L2: SMD  编带  BCMF062P120T  12R  4PIN  11.98GHZ  ±5%  比创达  ROHS; Part Reference: L14; Part Number: A1L03.00011; PCB Footprint: CML_SM4_0D45_0D5; Value: DP_BCMF062P120T; Part Type: 共模电感
L15 = MCZ1210AH900L2: SMD  编带  BCMF062P120T  12R  4PIN  11.98GHZ  ±5%  比创达  ROHS; Part Reference: L15; Part Number: A1L03.00011; PCB Footprint: CML_SM4_0D45_0D5; Value: HDMI_BCMF062P120T; Part Type: 共模电感
L16 = MCZ1210AH900L2: SMD  编带  BCMF062P120T  12R  4PIN  11.98GHZ  ±5%  比创达  ROHS; Part Reference: L16; Part Number: A1L03.00011; PCB Footprint: CML_SM4_0D45_0D5; Value: DP_BCMF062P120T; Part Type: 共模电感
L17 = MCZ1210AH900L2: SMD  编带  BCMF062P120T  12R  4PIN  11.98GHZ  ±5%  比创达  ROHS; Part Reference: L17; Part Number: A1L03.00011; PCB Footprint: CML_SM4_0D45_0D5; Value: HDMI_BCMF062P120T; Part Type: 共模电感
Q4 = NPN: SMD编带  SOT-323  SS8050  NPN  ROHS; Part Reference: Q4; Part Number: A1D01.00039; Temp Coeff: -55℃ to ＋150℃; PCB Footprint: SOT_323; Value: SS8050; Part Type: 三极管-MOS管
Q6 = MOSFET_NPN: SMD  编带  SOT-323  NX3008NBKW  N沟道  Nexperia(安世)  ROHS; Part Reference: Q6; Part Number: A1D01.00070; Temp Coeff: -55℃ to ＋150℃; Value: HDMI_NX3008NBKW; Part Type: 三极管-MOS管; PCB Footprint: SOT_323
Q9 = MOSFET_NPN: SMD  编带  SOT-323  2SK3018  N沟道  长晶  ROHS; Part Reference: Q9; Part Number: A1D01.00007; Temp Coeff: -55℃ to ＋150℃; Value: HDMI_2SK3018; Part Type: 三极管-MOS管; PCB Footprint: SOT_323
R7 = R: SMD  0201  0R  1/20W  ±1%  ROHS; Part Reference: R7; Part Number: A1R01.00001; PCB Footprint: R0201; Value: HDMI_0R 1%; Part Type: 贴片电阻
R8 = R: SMD  0201  0R  1/20W  ±1%  ROHS; Part Reference: R8; Part Number: A1R01.00001; PCB Footprint: R0201; Value: HDMI_0R 1%; Part Type: 贴片电阻
R9 = R: SMD  0201  2K  1/20W  ±1%  ROHS; Part Reference: R9; Part Number: A1R01.00112; PCB Footprint: R0201; Value: HDMI_2K 1%; Part Type: 贴片电阻
R16 = R: SMD  0201  2K  1/20W  ±1%  ROHS; Part Reference: R16; Part Number: A1R01.00112; PCB Footprint: R0201; Value: HDMI_2K 1%; Part Type: 贴片电阻
R17 = R: SMD  0402  10K  1/16W  ±1%  ROHS; Part Reference: R17; Part Number: A1R01.00222; PCB Footprint: R0402; Value: HDMI_10K 1%; Part Type: 贴片电阻
R18 = R: SMD  0201  0R  1/20W  ±1%  ROHS; Part Reference: R18; Part Number: A1R01.00001; PCB Footprint: R0201; Value: 0R 1%; Part Type: 贴片电阻
R23 = R: SMD  0201  0R  1/20W  ±1%  ROHS; Part Reference: R23; Part Number: A1R01.00001; PCB Footprint: R0201; Value: HDMI_0R 1%; Part Type: 贴片电阻
R24 = R: SMD  0201  0R  1/20W  ±1%  ROHS; Part Reference: R24; Part Number: A1R01.00001; PCB Footprint: R0201; Value: DP_0R 1%; Part Type: 贴片电阻
R25 = R: SMD  0201  0R  1/20W  ±1%  ROHS; Part Reference: R25; Part Number: A1R01.00001; PCB Footprint: R0201; Value: NC/0R 1%; Part Type: 贴片电阻
R26 = R: SMD  0402  10K  1/16W  ±1%  ROHS; Part Reference: R26; Part Number: A1R01.00222; PCB Footprint: R0402; Value: 10K 1%; Part Type: 贴片电阻
R27 = R: SMD  0201  499R  1/20W  ±1%  ROHS; Part Reference: R27; Part Number: A1R01.00073; PCB Footprint: R0201; Value: HDMI_499R 1%; Part Type: 贴片电阻
R29 = R: SMD  0201  499R  1/20W  ±1%  ROHS; Part Reference: R29; Part Number: A1R01.00073; PCB Footprint: R0201; Value: HDMI_499R 1%; Part Type: 贴片电阻
R30 = R: SMD  0201  499R  1/20W  ±1%  ROHS; Part Reference: R30; Part Number: A1R01.00073; PCB Footprint: R0201; Value: HDMI_499R 1%; Part Type: 贴片电阻
R31 = R: SMD  0201  499R  1/20W  ±1%  ROHS; Part Reference: R31; Part Number: A1R01.00073; PCB Footprint: R0201; Value: HDMI_499R 1%; Part Type: 贴片电阻
R32 = R: SMD  0201  499R  1/20W  ±1%  ROHS; Part Reference: R32; Part Number: A1R01.00073; PCB Footprint: R0201; Value: HDMI_499R 1%; Part Type: 贴片电阻
R33 = R: SMD  0201  499R  1/20W  ±1%  ROHS; Part Reference: R33; Part Number: A1R01.00073; PCB Footprint: R0201; Value: HDMI_499R 1%; Part Type: 贴片电阻
R72 = R: SMD  0402  3M  1/16W  ±5%  ROHS; Part Reference: R72; Part Number: A1R01.00390; PCB Footprint: R0402; Value: 3M 5%; Part Type: 贴片电阻
R75 = R: SMD  0201  499R  1/20W  ±1%  ROHS; Part Reference: R75; Part Number: A1R01.00073; PCB Footprint: R0201; Value: HDMI_499R 1%; Part Type: 贴片电阻
R76 = R: SMD  0201  499R  1/20W  ±1%  ROHS; Part Reference: R76; Part Number: A1R01.00073; PCB Footprint: R0201; Value: HDMI_499R 1%; Part Type: 贴片电阻
R77 = R: SMD  0201  100K  1/20W  ±5%  ROHS; Part Reference: R77; Part Number: A1R01.00006; PCB Footprint: R0201; Value: HDMI_100K 5%; Part Type: 贴片电阻
R127 = R: SMD  0402  162K  1/16W  ±1%  ROHS; Part Reference: R127; Part Number: A1R01.00562; PCB Footprint: R0402; Value: HDMI_162K 1%; Part Type: 贴片电阻
R128 = R: SMD  0402  32.4K  1/16W  ±1%  ROHS; Part Reference: R128; Part Number: A1R01.00412; PCB Footprint: R0402; Value: 32.4K 1%; Part Type: 贴片电阻
R131 = R: SMD  0402  0R  1/16W  ±1%  ROHS; Part Reference: R131; Part Number: A1R01.00219; PCB Footprint: R0402; Value: 0R 1%; Part Type: 贴片电阻
R132 = R: SMD  0201  6.8K  1/20W  ±1%  ROHS; Part Reference: R132; Part Number: A1R01.00158; PCB Footprint: R0201; Value: 6.8K 1%; Part Type: 贴片电阻
R133 = R: SMD  0402  100K  1/16W  ±1%  ROHS; Part Reference: R133; CDS_PHYS_PART_NAME: R_0402-100K,1 %,62.5MW,195-0005-000-100K,195-0005-000; CDS_PART_NAME: R_0402-100K,1 %,62.5MW,195-0005-000; Part Number: A1R01.00031; SEC: 1; XY: (-10500,4700); VER: 2; SIGNAL_MODEL: nv_res; ROT: 0; PHYS_PAGE: 16; PATH: I424; PACK_TYPE: 402; NV_PN: 195-0005-000; MAX_WATTAGE: 62.5mW; DRAWING: @P3449_B01_LIB.P3449_B01(SCH_1):PAGE16; DEVICE_TYPENAME: R_0402-100K1625MW195-0005-000-100K195-0005-000; CDS_LIB: discrete; ASSEMBLY: HDMI; Temp Coeff: －55℃ ~ ＋155℃; PCB Footprint: R0402; Value: 100K 1%; TOL: 1%; CHIPS_PART_NAME: R; CDS_SEC: 1; Part Type: 贴片电阻
R135 = R: SMD  0201  6.8K  1/20W  ±1%  ROHS; Part Reference: R135; Part Number: A1R01.00158; PCB Footprint: R0201; Value: DP_6.8K 1%; Part Type: 贴片电阻
R366 = R: SMD  0201  0R  1/20W  ±1%  ROHS; Part Reference: R366; Part Number: A1R01.00001; PCB Footprint: R0201; Value: NC/0R 1%; Part Type: 贴片电阻
R367 = R: SMD  0201  0R  1/20W  ±1%  ROHS; Part Reference: R367; Part Number: A1R01.00001; PCB Footprint: R0201; Value: NC/0R 1%; Part Type: 贴片电阻
R368 = R: SMD  0201  0R  1/20W  ±1%  ROHS; Part Reference: R368; Part Number: A1R01.00001; PCB Footprint: R0201; Value: NC/0R 1%; Part Type: 贴片电阻
R369 = R: SMD  0201  0R  1/20W  ±1%  ROHS; Part Reference: R369; Part Number: A1R01.00001; PCB Footprint: R0201; Value: NC/0R 1%; Part Type: 贴片电阻
R370 = R: SMD  0201  0R  1/20W  ±1%  ROHS; Part Reference: R370; Part Number: A1R01.00001; PCB Footprint: R0201; Value: NC/0R 1%; Part Type: 贴片电阻
R371 = R: SMD  0201  0R  1/20W  ±1%  ROHS; Part Reference: R371; Part Number: A1R01.00001; PCB Footprint: R0201; Value: NC/0R 1%; Part Type: 贴片电阻
R372 = R: SMD  0201  0R  1/20W  ±1%  ROHS; Part Reference: R372; Part Number: A1R01.00001; PCB Footprint: R0201; Value: NC/0R 1%; Part Type: 贴片电阻
R373 = R: SMD  0201  0R  1/20W  ±1%  ROHS; Part Reference: R373; Part Number: A1R01.00001; PCB Footprint: R0201; Value: NC/0R 1%; Part Type: 贴片电阻
R374 = R: SMD  0201  0R  1/20W  ±1%  ROHS; Part Reference: R374; Part Number: A1R01.00001; PCB Footprint: R0201; Value: NC_0R 1%; Part Type: 贴片电阻
R375 = R: SMD  0201  0R  1/20W  ±1%  ROHS; Part Reference: R375; Part Number: A1R01.00001; PCB Footprint: R0201; Value: NC_0R 1%; Part Type: 贴片电阻
R376 = R: SMD  0201  0R  1/20W  ±1%  ROHS; Part Reference: R376; Part Number: A1R01.00001; PCB Footprint: R0201; Value: NC_0R 1%; Part Type: 贴片电阻
R377 = R: SMD  0201  0R  1/20W  ±1%  ROHS; Part Reference: R377; Part Number: A1R01.00001; PCB Footprint: R0201; Value: NC_0R 1%; Part Type: 贴片电阻
R378 = R: SMD  0201  0R  1/20W  ±1%  ROHS; Part Reference: R378; Part Number: A1R01.00001; PCB Footprint: R0201; Value: NC_0R 1%; Part Type: 贴片电阻
R379 = R: SMD  0201  0R  1/20W  ±1%  ROHS; Part Reference: R379; Part Number: A1R01.00001; PCB Footprint: R0201; Value: NC_0R 1%; Part Type: 贴片电阻
R380 = R: SMD  0201  0R  1/20W  ±1%  ROHS; Part Reference: R380; Part Number: A1R01.00001; PCB Footprint: R0201; Value: NC_0R 1%; Part Type: 贴片电阻
R381 = R: SMD  0201  0R  1/20W  ±1%  ROHS; Part Reference: R381; Part Number: A1R01.00001; PCB Footprint: R0201; Value: NC_0R 1%; Part Type: 贴片电阻
R391 = R: SMD  0201  6.8K  1/20W  ±1%  ROHS; Part Reference: R391; Part Number: A1R01.00158; PCB Footprint: R0201; Value: 6.8K 1%; Part Type: 贴片电阻
U1 = PI3AUX221ZTAEX: Part Reference: U1; Value: PI3AUX221ZTAEX; PCB Footprint: UQFN12_0D4_2
U30 = WS4603: SMD  功率开关  WS4603E-5/TR  1.25H  SOT-23-5L  ROHS; Part Reference: U30; Part Number: A1I01.00241; Parameter: SOT23-5; ID: U-IC0020; Temp Coeff: -40℃ to 85℃; Value: DP_WS4603; Part Type: 集成电路/模块; PCB Footprint: SOT23_5
U82 = ESD73034D: SMD  编带  SON10  ESD73034D-10/TR  4Line 双向TVS  VRWM=3.3V  0.2pF  33W  WILLSEMI(韦尔)  ROHS; Part Reference: U82; Part Number: A1D02.00015; Parameter: ESD-ESD73034D-封装 SON10_2R50X1R00X0R50; PCB Footprint: XSON10_0D5_1D1X2D6; Value: DP_ESD73034D; Part Type: 二极管-ESD管-桥堆-TVS管
U88 = ESD73034D: SMD  编带  SON10  ESD73034D-10/TR  4Line 双向TVS  VRWM=3.3V  0.2pF  33W  WILLSEMI(韦尔)  ROHS; Part Reference: U88; Part Number: A1D02.00015; Parameter: ESD-ESD73034D-封装 SON10_2R50X1R00X0R50; PCB Footprint: XSON10_0D5_1D1X2D6; Value: HDMI_ESD73034D; Part Type: 二极管-ESD管-桥堆-TVS管
U89 = ESD73034D: SMD  编带  SON10  ESD73034D-10/TR  4Line 双向TVS  VRWM=3.3V  0.2pF  33W  WILLSEMI(韦尔)  ROHS; Part Reference: U89; Part Number: A1D02.00015; Parameter: ESD-ESD73034D-封装 SON10_2R50X1R00X0R50; PCB Footprint: XSON10_0D5_1D1X2D6; Value: DP_ESD73034D; Part Type: 二极管-ESD管-桥堆-TVS管
U99 = ESD73034D: SMD  编带  SON10  ESD73034D-10/TR  4Line 双向TVS  VRWM=3.3V  0.2pF  33W  WILLSEMI(韦尔)  ROHS; Part Reference: U99; Part Number: A1D02.00015; Parameter: ESD-ESD73034D-封装 SON10_2R50X1R00X0R50; PCB Footprint: XSON10_0D5_1D1X2D6; Value: HDMI_ESD73034D; Part Type: 二极管-ESD管-桥堆-TVS管
U108 = WS4603: SMD  功率开关  WS4603E-5/TR  1.25H  SOT-23-5L  ROHS; Part Reference: U108; Part Number: A1I01.00241; Parameter: SOT23-5; ID: U-IC0020; Temp Coeff: -40℃ to 85℃; Value: HDMI_WS4603; Part Type: 集成电路/模块; PCB Footprint: SOT23_5
U109 = DIO7002: SMD  USB限流  DIO7002AST5  SOT23-5  帝奥  ROHS; Part Reference: U109; Part Number: A1I01.00221; Value: HDMI_DIO7002; Part Type: 集成电路/模块; PCB Footprint: SOT23_5
*#15 = radxa_1010: Page Create Date: March  8, 1995; Page Size: =PageSize; Page Modify Date: =ModifiedDate